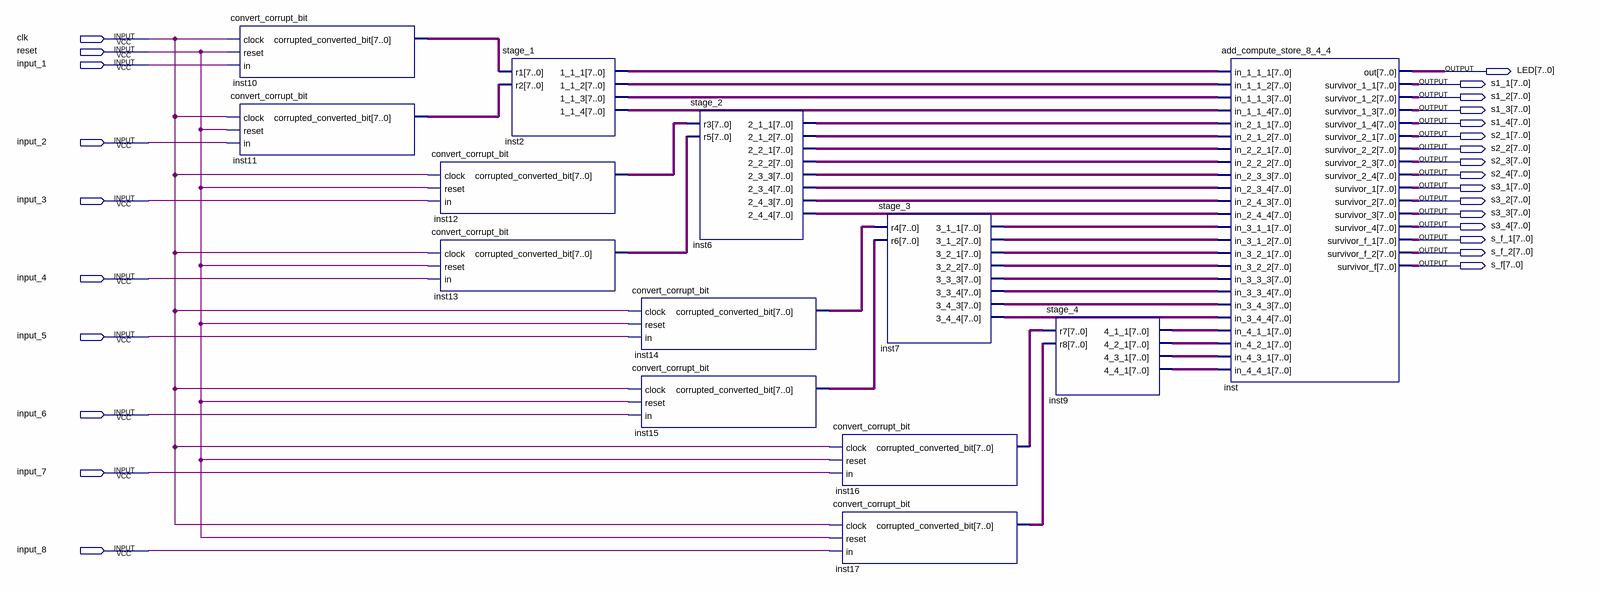
[diagram p0: schematic sheet]
// Quartus schematic top_level.bdf as structural Verilog: 13 symbols, 26 pins
module top_level (
  input  clk,
  input  reset,
  input  input_1,
  input  input_2,
  input  input_3,
  input  input_4,
  input  input_5,
  input  input_6,
  input  input_7,
  input  input_8,
  output [7:0] LED,
  output [7:0] s1_1,
  output [7:0] s1_2,
  output [7:0] s1_3,
  output [7:0] s1_4,
  output [7:0] s2_1,
  output [7:0] s2_2,
  output [7:0] s2_3,
  output [7:0] s2_4,
  output [7:0] s3_1,
  output [7:0] s3_2,
  output [7:0] s3_3,
  output [7:0] s3_4,
  output [7:0] s_f_1,
  output [7:0] s_f_2,
  output [7:0] s_f
);

  wire [7:0] inst2_1_1_1, inst2_1_1_2, inst2_1_1_3, inst2_1_1_4, inst6_2_1_1, inst6_2_1_2, inst6_2_2_1,
       inst6_2_2_2, inst6_2_3_3, inst6_2_3_4, inst6_2_4_3, inst6_2_4_4, inst7_3_1_1, inst7_3_1_2,
       inst7_3_2_1, inst7_3_2_2, inst7_3_3_3, inst7_3_3_4, inst7_3_4_3, inst7_3_4_4, inst9_4_1_1,
       inst9_4_2_1, inst9_4_3_1, inst9_4_4_1, inst10_corrupted_converted_bit, inst11_corrupted_converted_bit,
       inst12_corrupted_converted_bit, inst13_corrupted_converted_bit, inst14_corrupted_converted_bit,
       inst15_corrupted_converted_bit, inst16_corrupted_converted_bit, inst17_corrupted_converted_bit;

  convert_corrupt_bit inst10 (
    .clock(clk), .reset(reset), .in(input_1), .corrupted_converted_bit(inst10_corrupted_converted_bit));
  convert_corrupt_bit inst11 (
    .clock(clk), .reset(reset), .in(input_2), .corrupted_converted_bit(inst11_corrupted_converted_bit));
  convert_corrupt_bit inst12 (
    .clock(clk), .reset(reset), .in(input_3), .corrupted_converted_bit(inst12_corrupted_converted_bit));
  convert_corrupt_bit inst13 (
    .clock(clk), .reset(reset), .in(input_4), .corrupted_converted_bit(inst13_corrupted_converted_bit));
  stage_1 inst2 (
    .r1(inst10_corrupted_converted_bit), .r2(inst11_corrupted_converted_bit), .\1_1_1 (inst2_1_1_1),
    .\1_1_2 (inst2_1_1_2), .\1_1_3 (inst2_1_1_3), .\1_1_4 (inst2_1_1_4));
  convert_corrupt_bit inst14 (
    .clock(clk), .reset(reset), .in(input_5), .corrupted_converted_bit(inst14_corrupted_converted_bit));
  convert_corrupt_bit inst15 (
    .clock(clk), .reset(reset), .in(input_6), .corrupted_converted_bit(inst15_corrupted_converted_bit));
  stage_2 inst6 (
    .r3(inst12_corrupted_converted_bit), .r5(inst13_corrupted_converted_bit), .\2_1_1 (inst6_2_1_1),
    .\2_1_2 (inst6_2_1_2), .\2_2_1 (inst6_2_2_1), .\2_2_2 (inst6_2_2_2), .\2_3_3 (inst6_2_3_3),
    .\2_3_4 (inst6_2_3_4), .\2_4_3 (inst6_2_4_3), .\2_4_4 (inst6_2_4_4));
  convert_corrupt_bit inst16 (
    .clock(clk), .reset(reset), .in(input_7), .corrupted_converted_bit(inst16_corrupted_converted_bit));
  convert_corrupt_bit inst17 (
    .clock(clk), .reset(reset), .in(input_8), .corrupted_converted_bit(inst17_corrupted_converted_bit));
  stage_3 inst7 (
    .r4(inst14_corrupted_converted_bit), .r6(inst15_corrupted_converted_bit), .\3_1_1 (inst7_3_1_1),
    .\3_1_2 (inst7_3_1_2), .\3_2_1 (inst7_3_2_1), .\3_2_2 (inst7_3_2_2), .\3_3_3 (inst7_3_3_3),
    .\3_3_4 (inst7_3_3_4), .\3_4_3 (inst7_3_4_3), .\3_4_4 (inst7_3_4_4));
  stage_4 inst9 (
    .r7(inst16_corrupted_converted_bit), .r8(inst17_corrupted_converted_bit), .\4_1_1 (inst9_4_1_1),
    .\4_2_1 (inst9_4_2_1), .\4_3_1 (inst9_4_3_1), .\4_4_1 (inst9_4_4_1));
  add_compute_store_8_4_4 inst (
    .in_1_1_1(inst2_1_1_1), .in_1_1_2(inst2_1_1_2), .in_1_1_3(inst2_1_1_3), .in_1_1_4(inst2_1_1_4),
    .in_2_1_1(inst6_2_1_1), .in_2_1_2(inst6_2_1_2), .in_2_2_1(inst6_2_2_1), .in_2_2_2(inst6_2_2_2),
    .in_2_3_3(inst6_2_3_3), .in_2_3_4(inst6_2_3_4), .in_2_4_3(inst6_2_4_3), .in_2_4_4(inst6_2_4_4),
    .in_3_1_1(inst7_3_1_1), .in_3_1_2(inst7_3_1_2), .in_3_2_1(inst7_3_2_1), .in_3_2_2(inst7_3_2_2),
    .in_3_3_3(inst7_3_3_3), .in_3_3_4(inst7_3_3_4), .in_3_4_3(inst7_3_4_3), .in_3_4_4(inst7_3_4_4),
    .in_4_1_1(inst9_4_1_1), .in_4_2_1(inst9_4_2_1), .in_4_3_1(inst9_4_3_1), .in_4_4_1(inst9_4_4_1),
    .out(LED), .survivor_1_1(s1_1), .survivor_1_2(s1_2), .survivor_1_3(s1_3), .survivor_1_4(s1_4),
    .survivor_2_1(s2_1), .survivor_2_2(s2_2), .survivor_2_3(s2_3), .survivor_2_4(s2_4), .survivor_1(s3_1),
    .survivor_2(s3_2), .survivor_3(s3_3), .survivor_4(s3_4), .survivor_f_1(s_f_1), .survivor_f_2(s_f_2),
    .survivor_f(s_f));
endmodule
